# EAGLE design V07 (EAGLE 8.0.0)
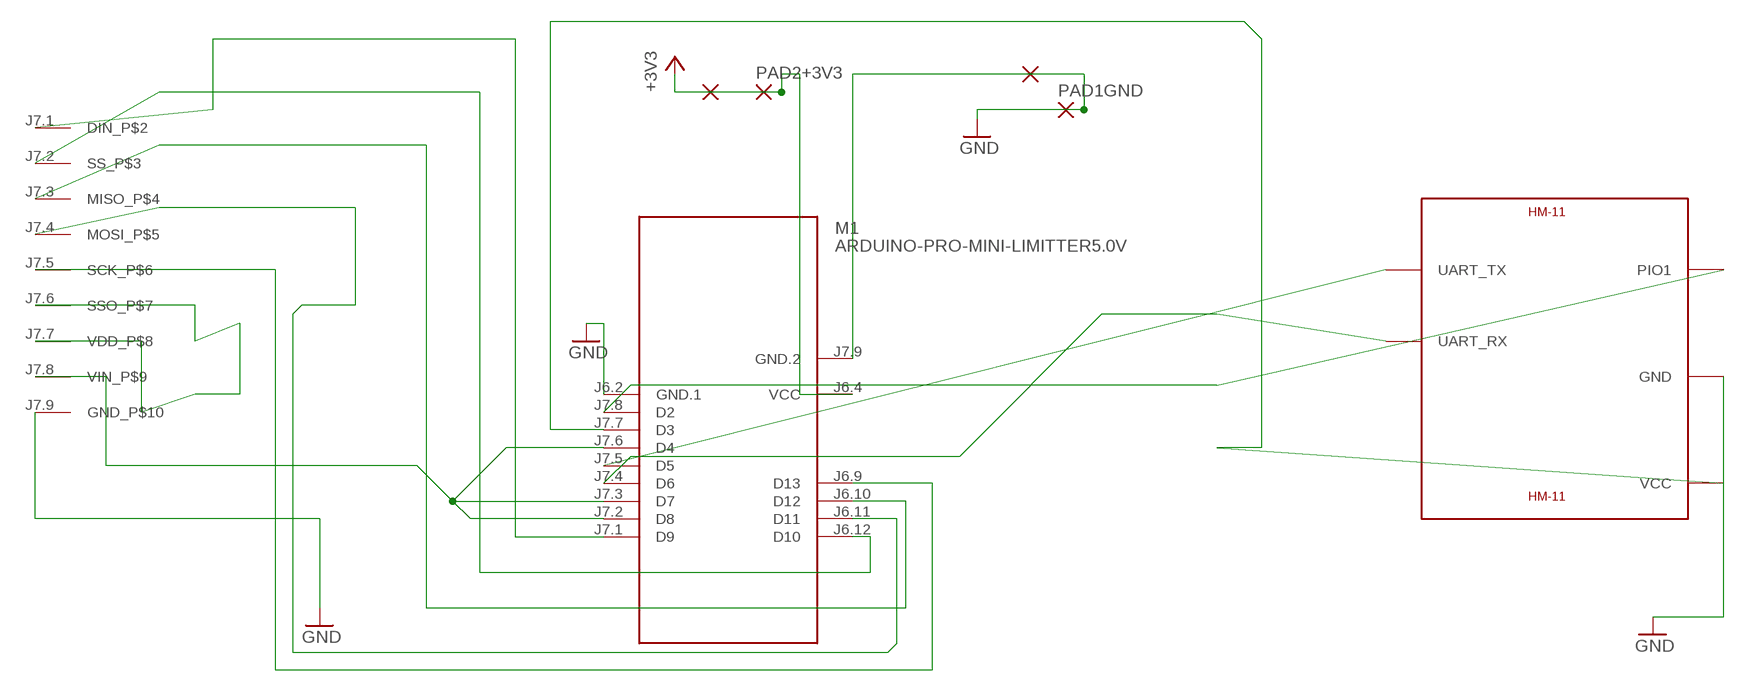
[diagram p0: schematic, sheet 1]

## Parts
M1  ARDUINO-PRO-MINI-LIMITTER5.0V  [ARDUINO-PRO-MINI]
PAD1GND  1,6/0,8  [1,6/0,8]
PAD2+3V3  1,6/0,8  [1,6/0,8]
U$1  ARDUINO-9PIN1MM  [ARDUINO-9PIN1MM]
U$2  HM-11  [HM-11]

## Nets
+3V3: M1.J6.4(VCC) PAD2+3V3.1(P)
BLEVCC-D3: M1.J7.7(D3) U$2.VCC
D2: M1.J7.8(D2) U$2.PIO1
D5: M1.J7.5(D5) U$2.UART_TX
D6: M1.J7.4(D6) U$2.UART_RX
D10: M1.J6.12(D10) U$1.J7.2(SS_P$3)
D11: M1.J6.11(D11) U$1.J7.4(MOSI_P$5)
D12: M1.J6.10(D12) U$1.J7.3(MISO_P$4)
D13: M1.J6.9(D13) U$1.J7.5(SCK_P$6)
DINP2: M1.J7.1(D9) U$1.J7.1(DIN_P$2)
GND: M1.J6.2(GND.1) M1.J7.9(GND.2) PAD1GND.1(P) U$1.J7.9(GND_P$10) U$2.GND
N$2: U$1.J7.6(SSO_P$7) U$1.J7.7(VDD_P$8)
VINP9-D8D7D4: M1.J7.2(D8) M1.J7.3(D7) M1.J7.6(D4) U$1.J7.8(VIN_P$9)

## Library data of the parts
M1 = arduino_pads:ARDUINO-PRO-MINI-LIMITTER: Arduino Pro Mini and compatible devices More details available here: https://www.arduino.cc/en/Main/ArduinoBoardProMini Click here to find device on ebay.com <http://www.ebay.com/sch/arduino+pro+mini>
PAD1GND PAD2+3V3 = wirepad:1,6/0,8: THROUGH-HOLE PAD
U$1 = arduino_pads:ARDUINO-9PIN1MM
U$2 = hm-11:HM-11: JNHuaMao HM-11 Bluetooth 4.0 Transceiver based on TI CC2540/CC2541

## Board
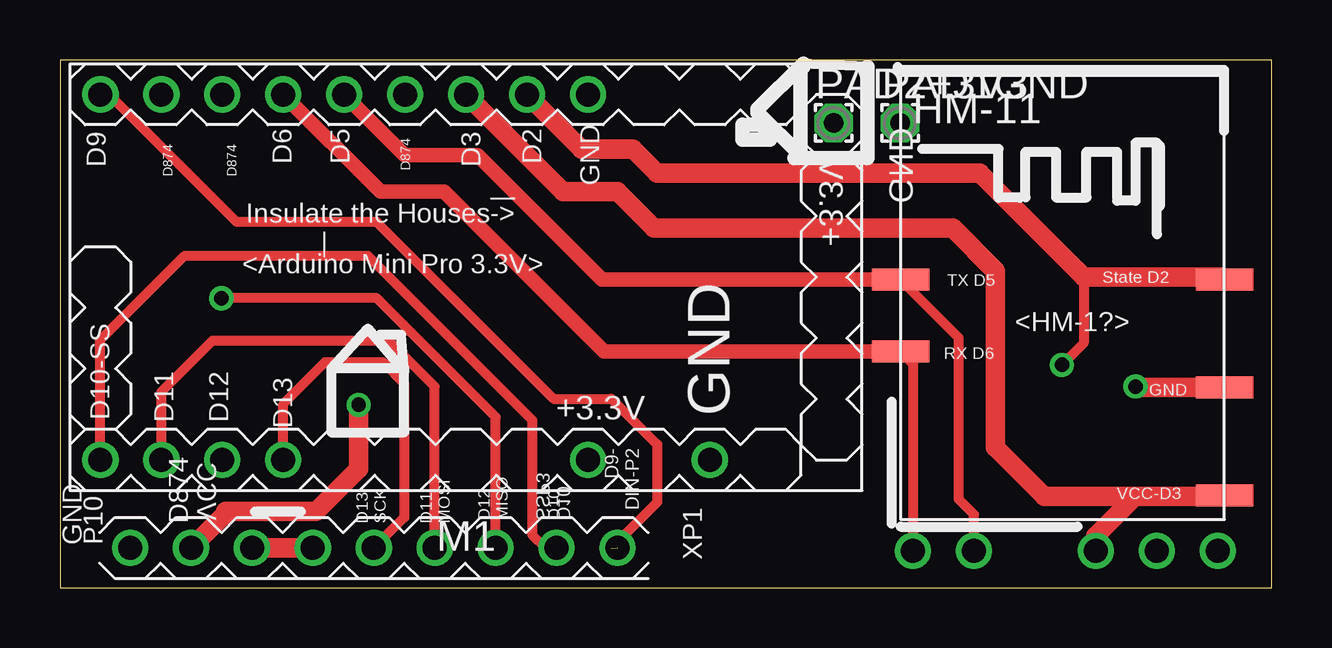
[diagram p1: board, top side]
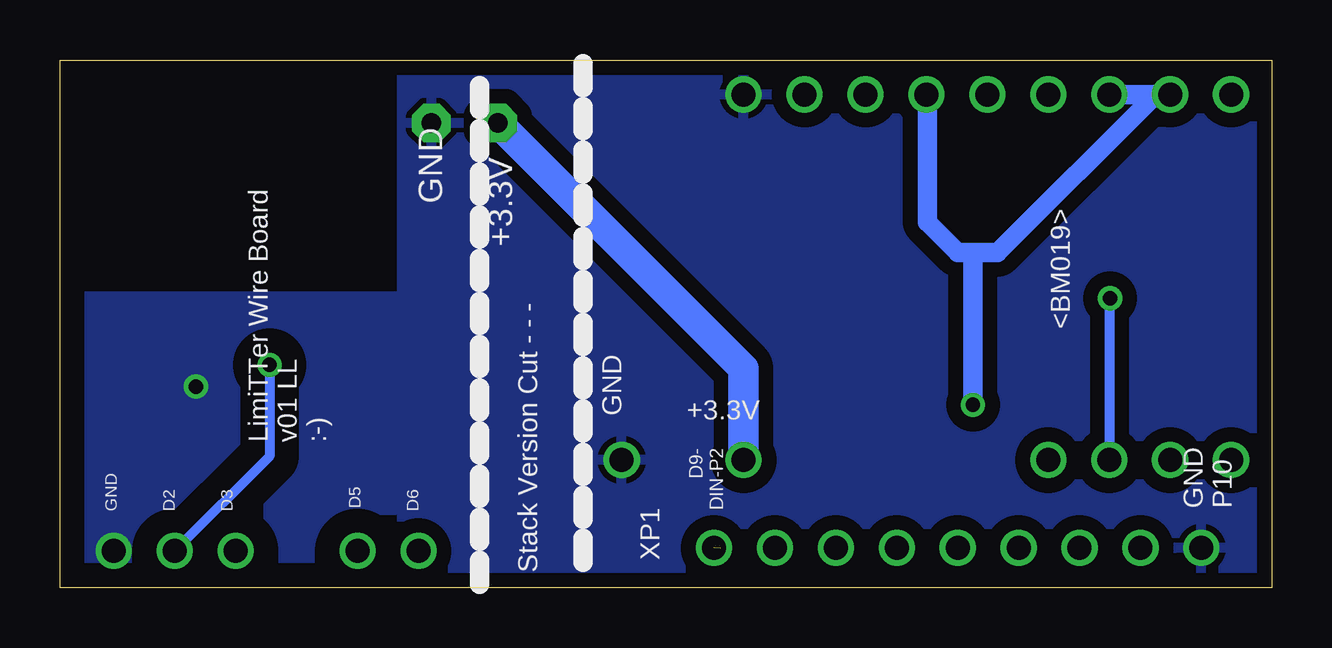
[diagram p2: board, bottom side, seen from below]

Size 50.5 x 22 mm. Coordinates in mm from the lower left corner, seen from the top.
Outline: 50.5,0 50.5,22 0,22 0,0 50.5,0
Copper layers (1*16): Top 0.035mm / dielectric 0.8mm / Bottom 0.035mm
Design rules "default *": minimum track width 10mil, minimum drill 0.3mm, track to track 0.3mm, track to pad 0.3mm, pad to pad 0.3mm, via to via 0.3mm, smd to smd 0.2mm, copper to edge 0.4mm, drill to drill 0.6mm, minimum pad ring 10mil, minimum via ring 8mil, stop-mask expansion 4mil, vias tented up to drill 0mil, thermal gap 10mil

### Footprints (pad centres in the part's own frame; a part is rotated, then mirrored left to right if it is on the bottom)
ARDUINO-PRO-MINI = drill 1: J6.2 -10.16,7.62; J6.4 -5.08,7.62; J6.9 7.62,7.62; J6.10 10.16,7.62; J6.11 12.7,7.62; J6.12 15.24,7.62; J7.1 15.24,-7.62; J7.2 12.7,-7.62; J7.3 10.16,-7.62; J7.4 7.62,-7.62; J7.5 5.08,-7.62; J7.6 2.54,-7.62; J7.7 0,-7.62; J7.8 -2.54,-7.62; J7.9 -5.08,-7.62
1,6/0,8 = drill 0.813 pad 1.6 octagon: 1 0,0
ARDUINO-9PIN1MM = drill 1: J7.1 21.59,0; J7.2 19.05,0; J7.3 16.51,0; J7.4 13.97,0; J7.5 11.43,0; J7.6 8.89,0; J7.7 6.35,0; J7.8 3.81,0; J7.9 1.27,0
HM-11 = smd 2.4 x 0.9: GND 6.5,0; PIO1 6.5,4.5; UART_RX -7,1.5; UART_TX -7,4.5; VCC 6.5,-4.5

### Placement (x,y rotation side)
M1  16.93,12.94 180 top
PAD1GND  35.02,19.37 0 top
PAD2+3V3  32.25,19.37 0 top
U$1  1.65,1.65 0 top
U$2  42.04,8.34 0 top

### Tracks (layer width: path | path; a pad name or v marks a point on that pad's centre or on a via)
+3V3
  Bottom 1.27: M1.J6.4 22.01,9.13 PAD2+3V3.1
BLEVCC-D3  (via drill 1)
  Top 0.406: U$2.VCC 47.72,3.84
  Top 0.813: M1.J7.7 20.98,16.51 23.24,16.51 24.77,14.99 37.21,14.99 38.99,13.21 38.99,5.84 41.02,3.81 44.83,3.81 | 44.83,3.81 48.5,3.81 U$2.VCC | v43.18,1.52 43.18,2.16 44.83,3.81
D2  (via drill 0.6, 1)
  Top 0.406: 42.67,12.95 42.67,10.19 v41.77,9.29
  Top 0.813: U$2.PIO1 48.43,12.95 42.67,12.95 38.35,17.27 24.89,17.27 23.88,18.29 21.74,18.29 M1.J7.8
  Bottom 0.406: v41.77,9.29 41.77,5.48 v45.72,1.52
D5  (via drill 1)
  Top 0.406: M1.J7.5 11.57,20.56 | v38.1,1.52 38.1,3.05 37.47,3.68 37.47,10.41 U$2.UART_TX
  Top 0.61: 20.51,14.92 20.83,14.61 | 20.51,14.92 17.4,18.03 14.37,18.03 M1.J7.5 | 20.51,14.92 22.59,12.84 U$2.UART_TX
D6  (via drill 1)
  Top 0.406: M1.J7.4 9.3,20.57 | U$2.UART_RX 35.56,9.32 v35.56,1.52
  Top 0.61: U$2.UART_RX 22.67,9.84 16,16.51 13.36,16.51 M1.J7.4
D10
  Top 0.406: M1.J6.12 1.69,10.32 5.21,13.84 12.83,13.84 19.68,6.99 19.68,2.21 20.24,1.65 U$1.J7.2
D11
  Top 0.406: M1.J6.11 4.23,8.16 6.35,10.29 13.72,10.29 15.62,8.38 U$1.J7.4
D12  (via drill 0.6)
  Top 0.406: U$1.J7.3 18.16,7.11 13.21,12.06 v6.73,12.06
  Bottom 0.406: v6.73,12.06 6.77,12.03 M1.J6.10
D13
  Top 0.406: M1.J6.9 9.31,7.66 11.05,9.4 13.46,9.4 14.35,8.51 14.35,2.92 U$1.J7.5
DINP2  (1 unrouted)
  Top 0.406: M1.J7.1 2.04,20.56 7.37,15.24 13.21,15.24 20.57,7.87 22.99,7.87 24.89,5.97 24.89,3.56 22.97,1.63
GND  (via drill 0.6, 1)
  Top 0.813: U$2.GND 44.87,8.34 v44.83,8.38
  other vias: 48.26,1.52
  pour Bottom (isolate 1.016): 33.75,11.94 33.75,1.33 49.75,1.33 49.75,11.94
  pour Bottom (isolate 0.61): 0.45,21.5 0.45,0.7 36.25,0.7 36.25,21.5
N$2
  Top 0.813: U$1.J7.7 U$1.J7.6
VINP9-D8D7D4  (via drill 0.6)
  Top 0.813: v12.45,7.62 12.45,4.95 10.67,3.17 6.9,3.17 6.9,3.09 U$1.J7.8
  Bottom 0.813: 4.83,20.56 M1.J7.2 | 4.83,20.56 M1.J7.3 | v12.45,7.62 12.45,13.97 | 12.45,13.97 13.08,13.97 14.35,15.24 14.35,20.53 M1.J7.6 | 12.45,13.97 11.42,13.97 4.83,20.56

### Text on the board
tPlace: D9 | D6 | D5 | D3 | D2 | D874 | D874 | D874 | GND | GND | Insulate the Houses!-> / | | <Arduino Mini Pro 3.3V> | +3.3V | TX D5 | State D2 | <HM-1?> | RX D6 | GND | D10-SS | D11 | D12 | D13 | +3.3V | GND | D9- / DIN-P2 | VCC-D3 | D874 | VCC | D13 / SCK | D11 / MOSI | D12 / MISO | D10 | D10 / SSP3 | GND / P10 | XP1
bPlace: <BM019> | GND | +3.3V | +3.3V | GND | D9- / DIN-P2 | LimiTTer Wire Board / v01 LL / :-) | GND / P10 | D6 | D5 | D3 | D2 | GND | XP1 | Stack Version Cut - - -
tDocu: D5-TX | D6-RX | GND